# Altium schematic sheet Connectors.SchDoc
size A4; SheetNumber: 1; SheetTotal: 1
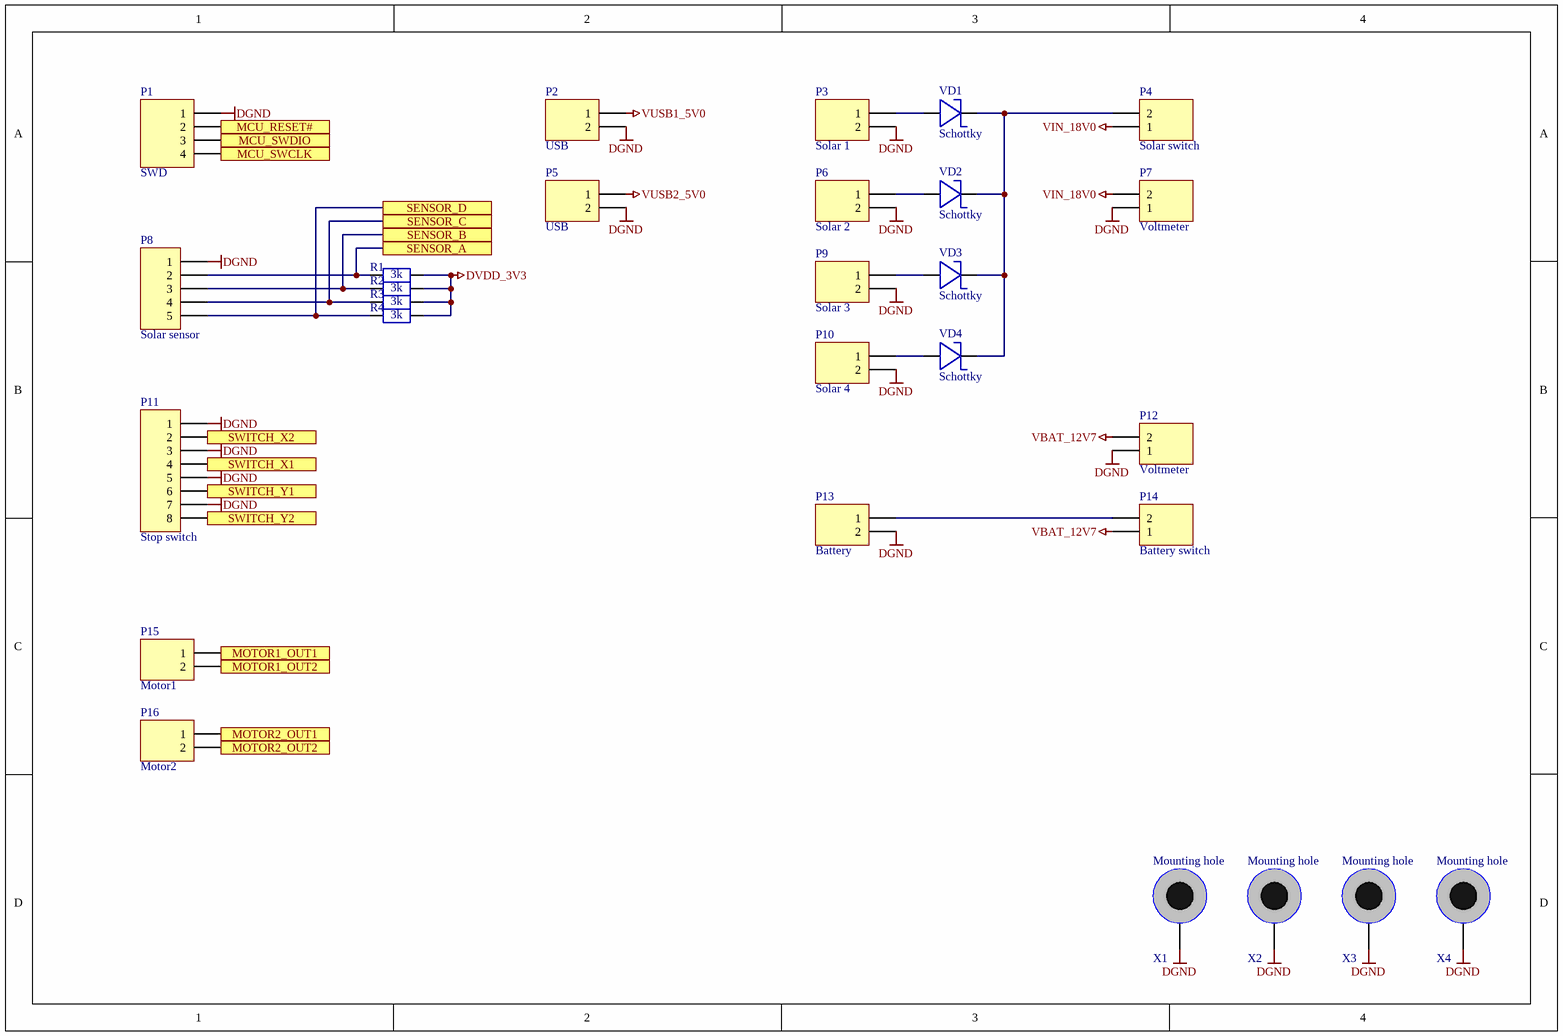
[diagram p0: Connectors.SchDoc]

## Parts
P1  SWD  [PLS-4 2.54]
P2  USB  [CWF-2]
P3  Solar 1  [CWF-2]
P4  Solar switch  [CWF-2]
P5  USB  [CWF-2]
P6  Solar 2  [CWF-2]
P7  Voltmeter  [CWF-2]
P8  Solar sensor  [HDR1X5]
P9  Solar 3  [CWF-2]
P10  Solar 4  [CWF-2]
P11  Stop switch  [HDR1X8]
P12  Voltmeter  [CWF-2]
P13  Battery  [CWF-2]
P14  Battery switch  [CWF-2]
P15  Motor1  [CWF-2]
P16  Motor2  [CWF-2]
R1  3k  [R_0603/1608]
R2  3k  [R_0603/1608]
R3  3k  [R_0603/1608]
R4  3k  [R_0603/1608]
VD1  Schottky  [DO214AC/SMA]
VD2  Schottky  [DO214AC/SMA]
VD3  Schottky  [DO214AC/SMA]
VD4  Schottky  [DO214AC/SMA]
X1  Mounting hole  [HOLE_M3_D6.0/3.5]  (no BOM)
X2  Mounting hole  [HOLE_M3_D6.0/3.5]  (no BOM)
X3  Mounting hole  [HOLE_M3_D6.0/3.5]  (no BOM)
X4  Mounting hole  [HOLE_M3_D6.0/3.5]  (no BOM)

## Ports
MCU_RESET#, MCU_SWCLK, MCU_SWDIO, MOTOR1_OUT1, MOTOR1_OUT2, MOTOR2_OUT1, MOTOR2_OUT2, SENSOR_A, SENSOR_B, SENSOR_C, SENSOR_D, SWITCH_X1, SWITCH_X2, SWITCH_Y1, SWITCH_Y2

## Nets
DGND: P1.1 P2.2 P3.2 P5.2 P6.2 P7.1 P8.1 P9.2 P10.2 P11.1 P11.3 P11.5 P11.7 P12.1 P13.2 X1.1 X2.1 X3.1 X4.1
DVDD_3V3: R1.1 R2.1 R3.1 R4.1
VBAT_12V7: P12.2 P14.1
VIN_18V0: P4.1 P7.2
VUSB1_5V0: P2.1
VUSB2_5V0: P5.1
MCU_RESET#: P1.2 ; port MCU_RESET#
MCU_SWCLK: P1.4 ; port MCU_SWCLK
MCU_SWDIO: P1.3 ; port MCU_SWDIO
MOTOR1_OUT1: P15.1 ; port MOTOR1_OUT1
MOTOR1_OUT2: P15.2 ; port MOTOR1_OUT2
MOTOR2_OUT1: P16.1 ; port MOTOR2_OUT1
MOTOR2_OUT2: P16.2 ; port MOTOR2_OUT2
SENSOR_A: P8.2 R1.2 ; port SENSOR_A
SENSOR_B: P8.3 R2.2 ; port SENSOR_B
SENSOR_C: P8.4 R3.2 ; port SENSOR_C
SENSOR_D: P8.5 R4.2 ; port SENSOR_D
SWITCH_X1: P11.4 ; port SWITCH_X1
SWITCH_X2: P11.2 ; port SWITCH_X2
SWITCH_Y1: P11.6 ; port SWITCH_Y1
SWITCH_Y2: P11.8 ; port SWITCH_Y2
NetP3_1: P3.1 VD1.1
NetP4_2: P4.2 VD1.2 VD2.2 VD3.2 VD4.2
NetP6_1: P6.1 VD2.1
NetP9_1: P9.1 VD3.1
NetP10_1: P10.1 VD4.1
NetP13_1: P13.1 P14.2

## Library data of the parts
P1 = Header 4: Header, 4-Pin; LatestRevisionDate: 17-Jul-2002; LatestRevisionNote: Re-released for DXP Platform.; Publisher: Altium Limited
P2-P7 P9 P10 P12-P16 = Header 2: Header, 2-Pin; LatestRevisionDate: 17-Jul-2002; LatestRevisionNote: Re-released for DXP Platform.; Publisher: Altium Limited
P8 = Header 5: Header, 5-Pin; LatestRevisionDate: 17-Jul-2002; LatestRevisionNote: Re-released for DXP Platform.; Publisher: Altium Limited
P11 = Header 8: Header, 8-Pin; LatestRevisionDate: 17-Jul-2002; LatestRevisionNote: Re-released for DXP Platform.; Publisher: Altium Limited
R1-R4 = Resistor
VD1-VD4 = Schottky: Schottky diode
X1-X4 = Mounting hole: Hole for screw M3, outline D6